# EAGLE schematic untitled (EAGLE 9.6.2)
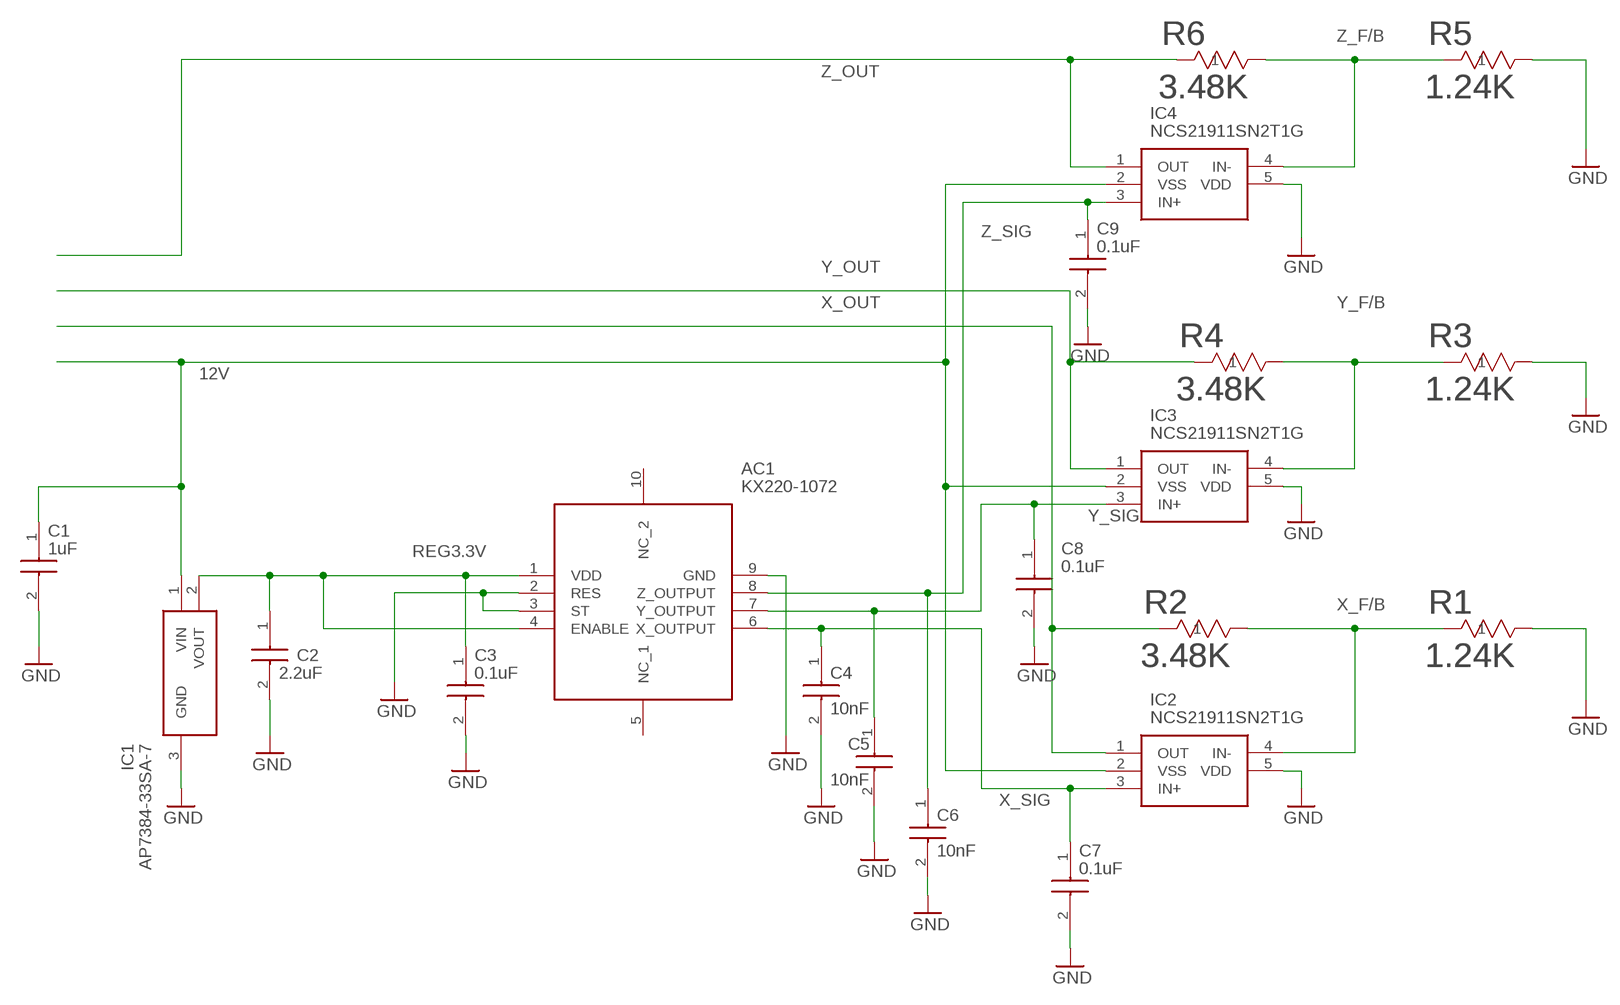
[diagram p0: schematic, sheet 1]

## Parts
AC1  KX220-1072  [KX2201072]
C1  1uF  CGA3E1X7R1V105K080AE  [CAPC1608X90N]
C2  2.2uF  CGA3E1X7R0J225K080AC  [CAPC1608X90N]
C3  0.1uF  CGA3E2X7R1H104K080AE  [CAPC1608X90N]
C4  10nF  CGA3E1C0G2A103J080AE  [CAPC1608X90N]
C5  10nF  CGA3E1C0G2A103J080AE  [CAPC1608X90N]
C6  10nF  CGA3E1C0G2A103J080AE  [CAPC1608X90N]
C7  0.1uF  CGA3E2X7R1H104K080AE  [CAPC1608X90N]
C8  0.1uF  CGA3E2X7R1H104K080AE  [CAPC1608X90N]
C9  0.1uF  CGA3E2X7R1H104K080AE  [CAPC1608X90N]
IC1  AP7384-33SA-7  [SOT96P240X110-3N]
IC2  NCS21911SN2T1G  [SOT95P275X110-5N]
IC3  NCS21911SN2T1G  [SOT95P275X110-5N]
IC4  NCS21911SN2T1G  [SOT95P275X110-5N]
R1  1.24K  TNPW04021K24BEED  [RES_TNPW0402_VIS]
R2  3.48K  TNPW04023K48BEED  [RES_TNPW0402_VIS]
R3  1.24K  TNPW04021K24BEED  [RES_TNPW0402_VIS]
R4  3.48K  TNPW04023K48BEED  [RES_TNPW0402_VIS]
R5  1.24K  TNPW04021K24BEED  [RES_TNPW0402_VIS]
R6  3.48K  TNPW04023K48BEED  [RES_TNPW0402_VIS]

## Nets
12V: C1.1 IC1.1(VIN) IC2.2(VSS) IC3.2(VSS) IC4.2(VSS)
GND: AC1.2(RES) AC1.3(ST) AC1.9(GND) C1.2 C2.2 C3.2 C4.2 C5.2 C6.2 C7.2 C8.2 C9.2 IC1.3(GND) IC2.5(VDD) IC3.5(VDD) IC4.5(VDD) R1.2 R3.2 R5.2
REG3.3V: AC1.1(VDD) AC1.4(ENABLE) C2.1 C3.1 IC1.2(VOUT)
X_F/B: IC2.4(IN-) R1.1 R2.2
X_OUT: IC2.1(OUT) R2.1
X_SIG: AC1.6(X_OUTPUT) C4.1 C7.1 IC2.3(IN+)
Y_F/B: IC3.4(IN-) R3.1 R4.2
Y_OUT: IC3.1(OUT) R4.1
Y_SIG: AC1.7(Y_OUTPUT) C5.1 C8.1 IC3.3(IN+)
Z_F/B: IC4.4(IN-) R5.1 R6.2
Z_OUT: IC4.1(OUT) R6.1
Z_SIG: AC1.8(Z_OUTPUT) C6.1 C9.1 IC4.3(IN+)
Unconnected: AC1.5(NC_1) AC1.10(NC_2)

## Library data of the parts
AC1 = SamacSys_Parts:KX220-1072: MEMS ACCELEROMETERS, 40G; MEMS Sensor Output:Analogue; Measurement Axis:X, Y, Z; Acceleration Range:+/- 40g; Supply Voltage Min:1.8V; Supply Voltage Max:3.6V; Sensor Case Style:LGA; No. of Pins:10Pins; Sensitivity Typ:30mV/g; RoHS Compliant: Yes Source: Datasheet <https://componentsearchengine.com/Datasheets/1/KX220-1072.pdf>; DESCRIPTION: MEMS ACCELEROMETERS, 40G; MEMS Sensor Output:Analogue; Measurement Axis:X, Y, Z; Acceleration Range:+/- 40g; Supply Voltage Min:1.8V; Supply Voltage Max:3.6V; Sensor Case Style:LGA; No. of Pins:10Pins; Sensitivity Typ:30mV/g; RoHS Compliant: Yes; HEIGHT: 1.01mm; MANUFACTURER_NAME: Kionix; MANUFACTURER_PART_NUMBER: KX220-1072; MOUSER_PART_NUMBER: 912-KX220-1072; MOUSER_PRICE-STOCK: https://www.mouser.co.uk/ProductDetail/Kionix/KX220-1072?qs=W0yvOO0ixfHJG%2FXzR0NLpg%3D%3D
C1 = SamacSys_Parts:CGA3E1X7R1V105K080AE: Multilayer Ceramic Capacitors MLCC - SMD/SMT 0603 1uF 35volts X7R 10% Soft Term Source: Datasheet <https://product.tdk.com/system/files/dam/doc/product/capacitor/ceramic/mlcc/catalog/mlcc_automotive_soft_en.pdf>; DESCRIPTION: Multilayer Ceramic Capacitors MLCC - SMD/SMT 0603 1uF 35volts X7R 10% Soft Term; HEIGHT: 0.9mm; MANUFACTURER_NAME: TDK; MANUFACTURER_PART_NUMBER: CGA3E1X7R1V105K080AE; MOUSER_PART_NUMBER: 810-CGA3E1X7R1V105KA; MOUSER_PRICE-STOCK: https://www.mouser.co.uk/ProductDetail/TDK/CGA3E1X7R1V105K080AE?qs=nQSIdc08i%252BfiPojSMYifNA%3D%3D
C2 = SamacSys_Parts:CGA3E1X7R0J225K080AC: Multilayer Ceramic Chip Capacitors, Capacitance=2.2uF, LxWxT:1.6x0.8x0.8mm Source: Datasheet <https://product.tdk.com/system/files/dam/doc/product/capacitor/ceramic/mlcc/catalog/mlcc_automotive_general_en.pdf>; DESCRIPTION: Multilayer Ceramic Chip Capacitors, Capacitance=2.2uF, LxWxT:1.6x0.8x0.8mm; HEIGHT: 0.9mm; MANUFACTURER_NAME: TDK; MANUFACTURER_PART_NUMBER: CGA3E1X7R0J225K080AC; MOUSER_PART_NUMBER: 810-CGA3E1X7R0J225K; MOUSER_PRICE-STOCK: https://www.mouser.co.uk/ProductDetail/TDK/CGA3E1X7R0J225K080AC?qs=NRhsANhppD%252BCEJjlpJUsyg%3D%3D
C3 C7-C9 = SamacSys_Parts:CGA3E2X7R1H104K080AE: Multilayer Ceramic Chip Capacitors, Capacitance=0.1uF, LxWxT:1.6x0.8x0.8mm Source: Datasheet <https://product.tdk.com/system/files/dam/doc/product/capacitor/ceramic/mlcc/catalog/mlcc_automotive_soft_en.pdf>; DESCRIPTION: Multilayer Ceramic Chip Capacitors, Capacitance=0.1uF, LxWxT:1.6x0.8x0.8mm; HEIGHT: 0.9mm; MANUFACTURER_NAME: TDK; MANUFACTURER_PART_NUMBER: CGA3E2X7R1H104K080AE; MOUSER_PART_NUMBER: 810-CGA3E2X7R1H104KE; MOUSER_PRICE-STOCK: https://www.mouser.co.uk/ProductDetail/TDK/CGA3E2X7R1H104K080AE?qs=n%2FVzw7c4a0kvajqFvEbDzQ%3D%3D
C4-C6 = SamacSys_Parts:CGA3E1C0G2A103J080AE: Multilayer Ceramic Capacitors MLCC - SMD/SMT 0603 100V 10nF 5% SOFT C0G AEC-Q200 Source: Datasheet <https://product.tdk.com/system/files/dam/doc/product/capacitor/ceramic/mlcc/catalog/mlcc_automotive_soft_en.pdf>; DESCRIPTION: Multilayer Ceramic Capacitors MLCC - SMD/SMT 0603 100V 10nF 5% SOFT C0G AEC-Q200; HEIGHT: 0.9mm; MANUFACTURER_NAME: TDK; MANUFACTURER_PART_NUMBER: CGA3E1C0G2A103J080AE; MOUSER_PART_NUMBER: 810-CGA3E1C0G2A103J0; MOUSER_PRICE-STOCK: https://www.mouser.co.uk/ProductDetail/TDK/CGA3E1C0G2A103J080AE?qs=r5DSvlrkXmK9f6QnOjYfCw%3D%3D
IC1 = SamacSys_Parts:AP7384-33SA-7: LDO Regulator Pos 3.3V 0.05A 3-Pin SOT-23 T/R Source: Datasheet; DESCRIPTION: LDO Regulator Pos 3.3V 0.05A 3-Pin SOT-23 T/R; HEIGHT: 1.1mm; MANUFACTURER_NAME: Diodes Inc.; MANUFACTURER_PART_NUMBER: AP7384-33SA-7; MOUSER_PART_NUMBER: 621-AP7384-33SA-7; MOUSER_PRICE-STOCK: https://www.mouser.co.uk/ProductDetail/Diodes-Incorporated/AP7384-33SA-7?qs=y6ZabgHbY%252BzFaFb6roH6pQ%3D%3D
IC2-IC4 = SamacSys_Parts:NCS21911SN2T1G: Operational Amplifiers - Op Amps 2 MHz Source: Datasheet <https://www.arrow.com/en/products/ncs21911sn2t1g/on-semiconductor>; DESCRIPTION: Operational Amplifiers - Op Amps 2 MHz; HEIGHT: 1.1mm; MANUFACTURER_NAME: ON Semiconductor; MANUFACTURER_PART_NUMBER: NCS21911SN2T1G; MOUSER_PART_NUMBER: 863-NCS21911SN2T1G; MOUSER_PRICE-STOCK: https://www.mouser.co.uk/ProductDetail/onsemi/NCS21911SN2T1G?qs=%252B6g0mu59x7Ix%2FTFBhvJ5Cw%3D%3D
R1 R3 R5 = SamacSys_Parts:TNPW04021K24BEED; COPYRIGHT: Copyright (C) 2022 Ultra Librarian. All rights reserved.; MANUFACTURER_PART_NUMBER: TNPW04021K24BEED; MFR_NAME: Vishay
R2 R4 R6 = SamacSys_Parts:TNPW04023K48BEED; COPYRIGHT: Copyright (C) 2022 Ultra Librarian. All rights reserved.; MANUFACTURER_PART_NUMBER: TNPW04023K48BEED; MFR_NAME: Vishay